# Altium schematic sheet Battery connections.SchDoc
size A
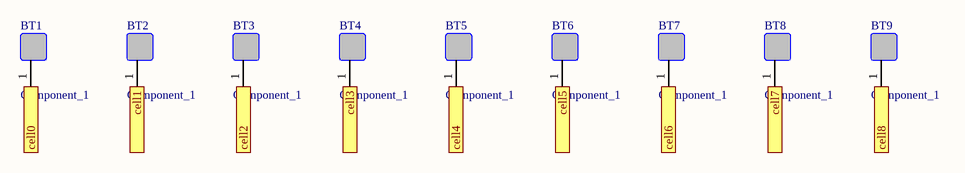
[diagram p0: Battery connections.SchDoc]

## Parts
BT1  Component_1  [Battery pad]
BT2  Component_1  [Battery pad]
BT3  Component_1  [Battery pad]
BT4  Component_1  [Battery pad]
BT5  Component_1  [Battery pad]
BT6  Component_1  [Battery pad]
BT7  Component_1  [Battery pad]
BT8  Component_1  [Battery pad]
BT9  Component_1  [Battery pad]

## Ports
cell0 (out), cell1 (out), cell2 (out), cell3 (out), cell4 (out), cell5 (out), cell6 (out), cell7 (out), cell8 (out)

## Nets
cell0: BT1.1(pin_1) ; port cell0
cell1: BT2.1(pin_1) ; port cell1
cell2: BT3.1(pin_1) ; port cell2
cell3: BT4.1(pin_1) ; port cell3
cell4: BT5.1(pin_1) ; port cell4
cell5: BT6.1(pin_1) ; port cell5
cell6: BT7.1(pin_1) ; port cell6
cell7: BT8.1(pin_1) ; port cell7
cell8: BT9.1(pin_1) ; port cell8